# EAGLE design full_Bridge_v2 (EAGLE 9.6.2)

## Sheet 1 of 2
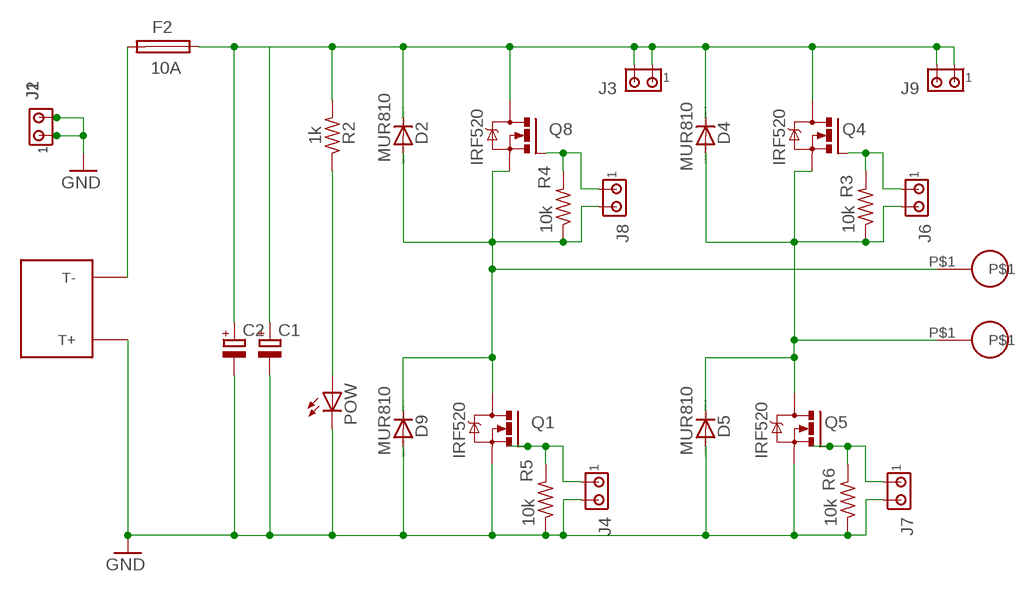
[diagram p0: schematic, sheet 1]

### Parts
AC1  TERMINAL  [TERMINAL]
AC2  TERMINAL  [TERMINAL]
C1  CPOL-EUTT5D10  [TT5D10]
C2  CPOL-EUTT5D10  [TT5D10]
D2  MUR810  [TO220ACS]
D4  MUR810  [TO220ACS]
D5  MUR810  [TO220ACS]
D9  MUR810  [TO220ACS]
F2  10A  SH22,5A  [SH22,5A]
J1  MTA02-100  [10X02MTA]
J2  MTA02-100  [10X02MTA]
J3  MTA02-100  [10X02MTA]
J4  MTA02-100  [10X02MTA]
J6  MTA02-100  [10X02MTA]
J7  MTA02-100  [10X02MTA]
J8  MTA02-100  [10X02MTA]
J9  MTA02-100  [10X02MTA]
POW  LED3MM  [LED3MM]
Q1  IRF520  [TO220BV]
Q4  IRF520  [TO220BV]
Q5  IRF520  [TO220BV]
Q8  IRF520  [TO220BV]
R2  1k  R-US_0207/12  [0207/12]
R3  10k  R-US_0204/7  [0204/7]
R4  10k  R-US_0204/7  [0204/7]
R5  10k  R-US_0204/7  [0204/7]
R6  10k  R-US_0204/7  [0204/7]
U$5  CONNECTOR_BIG  [CONNECTOR_BIG]

### Nets
A_MID: AC1.P$1 D2.A D9.C J8.2 Q1.D Q8.S R4.1
A_MID1: AC2.P$1 D4.A D5.C J6.2 Q4.S Q5.D R3.1
DC_BUS: C1.+ C2.+ D2.C D4.C F2.1 J3.1 J3.2 J9.1 J9.2 Q4.D Q8.D R2.2
GND: C1.- C2.- D5.A D9.A J1.1 J1.2 J2.1 J2.2 J4.2 J7.2 POW.K(C) Q1.S Q5.S R5.1 R6.1 U$5.P$1(T+)
IN+: F2.2 U$5.P$2(T-)
N$1: POW.A R2.1
N$4: J6.1 Q4.G R3.2
N$5: J7.1 Q5.G R6.2
N$10: J4.1 Q1.G R5.2
N$13: J8.1 Q8.G R4.2

## Sheet 2 of 2

## Library data of the parts
AC1 AC2 = terminal:TERMINAL
C1 C2 = rcl:CPOL-EU: POLARIZED CAPACITOR, European symbol
D2 D4 D5 D9 = diode:MUR810: DIODE
F2 = fuse:SH22,5A: FUSE HOLDER grid 22,5mm, isolated cap OGN0031 8201, Schurter (Buerklin); MPN: 0031.7701.11; OC_FARNELL: unknown; OC_NEWARK: 04F1224
J1-J4 J6-J9 = con-amp:MTA02-100: AMP connector
POW = adafruit:LED: LED OSRAM: - CHIPLED LG R971, LG N971, LY N971, LG Q971, LY Q971, LO R971, LY R971 LH N974, LH R974 LS Q976, LO Q976, LY Q976 LO Q996 - Hyper CHIPLED LW Q18S LB Q993, LB Q99A, LB R99A - SideLED LS A670, LO A670, LY A670, LG A670, LP A670 LB A673, LV A673, LT A673, LW A673 LH A674 LY A675 LS A676, LA A676, LO A676, LY A676, LW A676 LS A679, LY A679, LG A679 - Hyper Micro SIDELED® LS Y876, LA Y876, LO Y876, LY Y876 LT Y87S - SmartLED LW L88C, LW L88S LB L89C, LB L89S, LG L890 LS L89K, LO L89K, LY L89K LS L896, LA L896, LO L896, LY L896 - TOPLED LS T670, LO T670, LY T670, LG T670, LP T670 LSG T670, LSP T670, LSY T670, LOP T670, LYG T670 LG T671, LOG T671, LSG T671 LB T673, LV T673, LT T673, LW T673 LH T674 LS T676, LA T676, LO T676, LY T676, LB T676, LH T676, LSB T676, LW T676 LB T67C, LV T67C, LT T67C, LS T67K, LO T67K, LY T67K, LW E67C LS E67B, LA E67B, LO E67B, LY E67B, LB E67C, LV E67C, LT E67C LW T67C LS T679, LY T679, LG T679 LS T770, LO T770, LY T770, LG T770, LP T770 LB T773, LV T773, LT T773, LW T773 LH T774 LS E675, LA E675, LY E675, LS T675 LS T776, LA T776, LO T776, LY T776, LB T776 LHGB T686 LT T68C, LB T68C - Hyper Mini TOPLED® LB M676 - Mini TOPLED Santana® LG M470 LS M47K, LO M47K, LY M47K Source: http://www.osram.convergy.de/
Q1 Q4 Q5 Q8 = transistor-power:IRF520: HEXFET Power MOSFET
R2-R6 = adafruit:R-US_: RESISTOR, American symbol
U$5 = Connector big:CONNECTOR_BIG

## Board
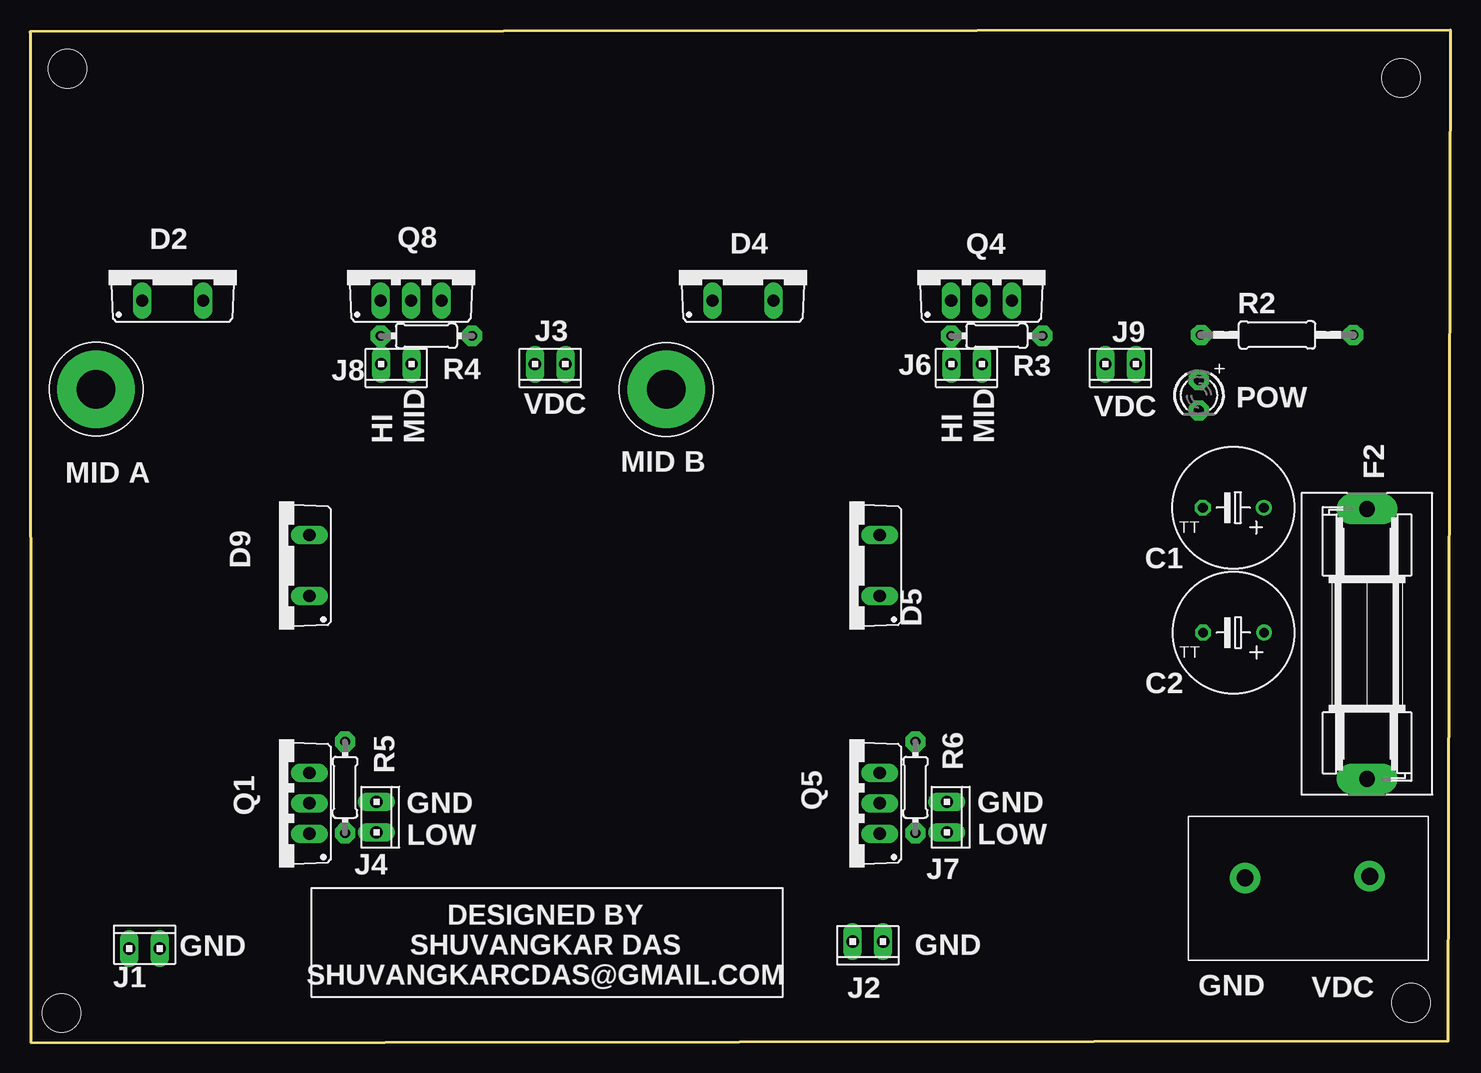
[diagram p1: board, top side]
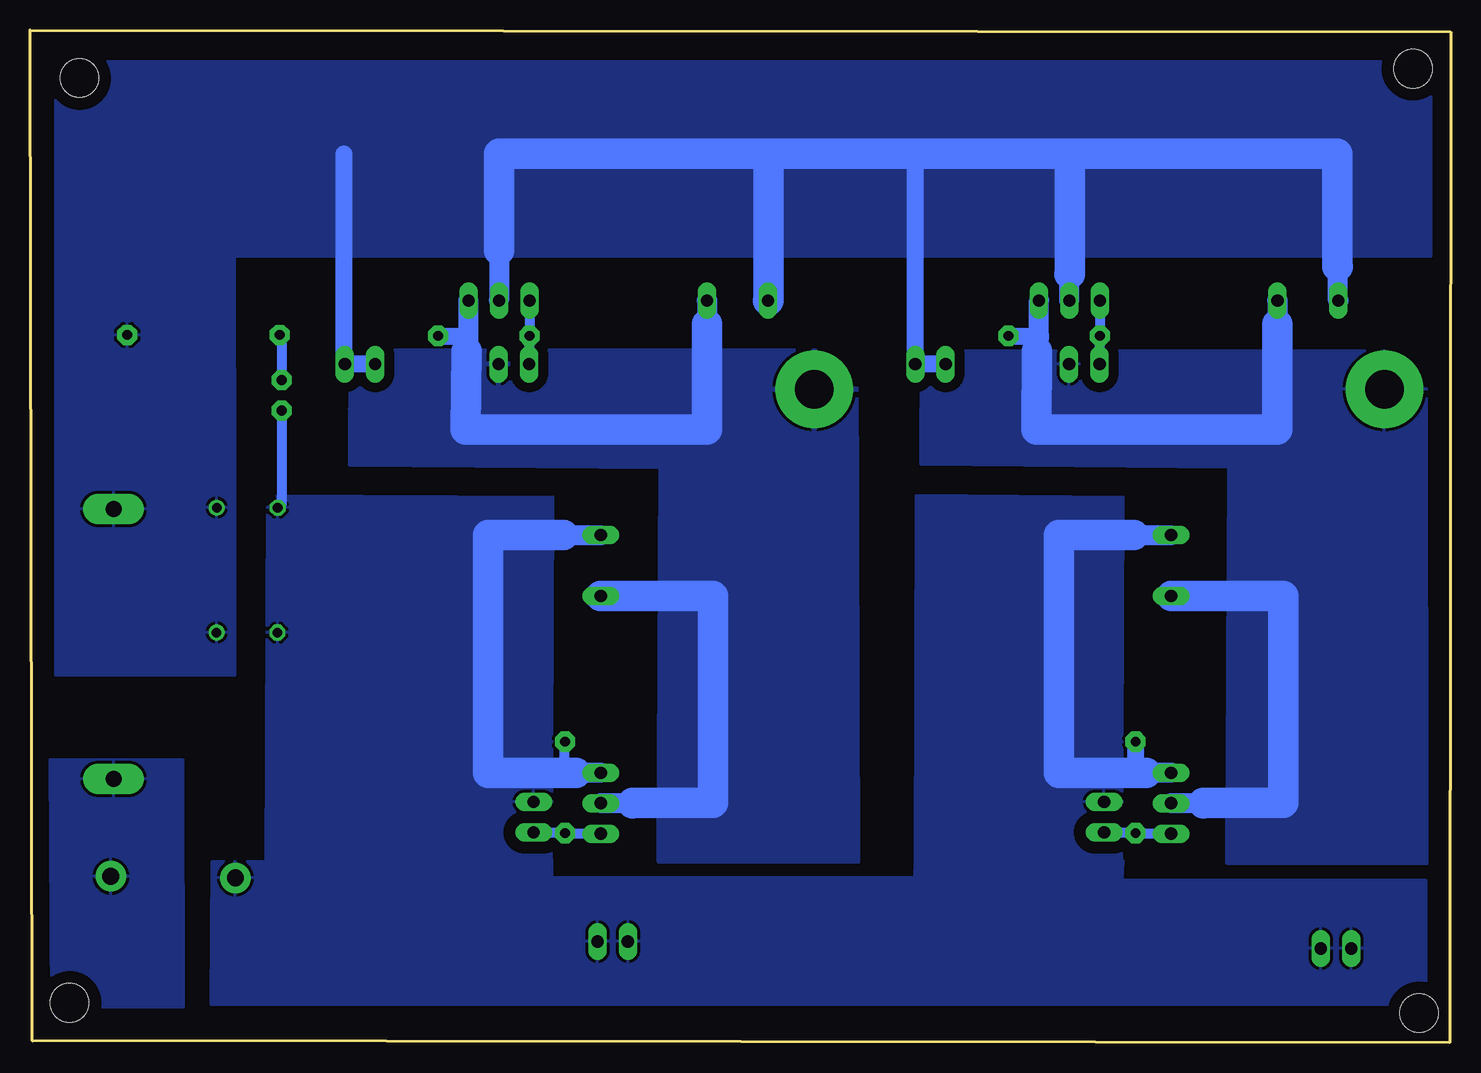
[diagram p2: board, bottom side, seen from below]

Size 118.42 x 84.43 mm. Coordinates in mm from the lower left corner, seen from the top.
Outline: 0.08,0 118.22,0.15 118.42,84.43 0,84.28 0.08,0
Copper layers (1*16): Top 0.035mm / dielectric 1.5mm / Bottom 0.035mm
Design rules "default *": minimum track width 10mil, minimum drill 24mil, track to track 8mil, track to pad 8mil, pad to pad 8mil, via to via 8mil, smd to smd 8mil, copper to edge 40mil, drill to drill 8mil, minimum pad ring 10mil, minimum via ring 8mil, stop-mask expansion 4mil, vias tented up to drill 0mil, thermal gap 10mil
Holes 3.2 mm at 3.12,81.2 114.3,80.42 2.62,2.46 115.11,3.33
vRestrict: area 0.6,4.5 to 20.6,57; area 48.2,5.1 to 68.2,57.7; area 26.3,3.1 to 46.8,57.8; area 73.8,3.4 to 94.3,58.1

### Footprints (pad centres in the part's own frame; a part is rotated, then mirrored left to right if it is on the bottom)
TERMINAL = drill 3.2 pad 6.452: P$1 0,0
TT5D10 = drill 0.813: + -2.54,0 | drill 0.813 octagon: - 2.54,0
TO220ACS = drill 1.016 long: A 2.54,-2.54; C -2.54,-2.54
SH22,5A = drill 1.321 pad 2.54 long: 1 -11.252,0; 2 11.252,0
10X02MTA = drill 1.016 long: 1 1.27,0; 2 -1.27,0
LED3MM = drill 0.813 pad 1.676 octagon: A -1.27,0; K 1.27,0
TO220BV = drill 1.016 long: D 0,-2.54; G -2.54,-2.54; S 2.54,-2.54
0207/12 = drill 0.813 pad 1.676 octagon: 1 -6.35,0; 2 6.35,0
0204/7 = drill 0.813 pad 1.676 octagon: 1 -3.81,0; 2 3.81,0
CONNECTOR_BIG = drill 1.4 pad 2.54: P$1 0.127,-5.254; P$2 0,5.127

### Placement (x,y rotation side)
AC1  5.51,54.48 0 top
AC2  53.04,54.46 0 top
C1  100.3,44.6 180 top
C2  100.33,34.19 180 top
D2  11.89,64.41 0 top
D4  59.44,64.41 0 top
D5  68.3,39.78 90 top
D9  20.75,39.78 90 top
F2  111.46,33.25 270 top
J1  9.55,7.85 0 top
J2  69.85,8.43 180 top
J3  43.36,56.57 180 top
J4  28.88,18.8 270 top
J6  78.08,56.57 180 top
J7  76.43,18.8 270 top
J8  30.53,56.57 180 top
J9  90.91,56.57 180 top
POW  97.43,53.98 270 top
Q1  20.75,19.96 90 top
Q4  79.32,64.41 0 top
Q5  68.3,19.96 90 top
Q8  31.78,64.41 0 top
R2  103.96,59 0 top
R3  80.59,58.93 180 top
R4  33.05,58.93 180 top
R5  26.26,21.29 270 top
R6  73.81,21.29 270 top
U$5  106.55,13.87 270 top

### Tracks (layer width: path | path; a pad name or v marks a point on that pad's centre or on a via)
A_MID
  Bottom 0.813: 34.34,58.93 34.32,58.95
  Bottom 1.422: R4.1 34.49,58.93 34.32,58.75
  Bottom 1.676: 20.63,19.96 Q1.D | D2.A 14.45,61.87 14.45,59.92 | 34.47,57.66 34.32,57.66 34.32,58.75 34.32,58.95 Q8.S
  Bottom 2.54: D9.C 13.94,37.24 13.94,19.99 20.63,19.99 20.63,19.96 | 14.45,59.92 14.45,51.13 34.54,51.13 34.47,57.66
  pour Bottom (isolate 0.813): 44.12,57.73 2.03,57.71 1.98,14.88 18.64,14.91 18.49,47.96 44.15,48.18
A_MID1
  Bottom 1.422: R3.1 81.94,58.93 81.86,59
  Bottom 1.676: 68.17,19.96 Q5.D | D4.A 62,61.87 62,59.92 | 82.02,57.66 81.86,57.66 81.86,59 Q4.S
  Bottom 2.54: D5.C 61.49,37.24 61.49,19.99 68.17,19.99 68.17,19.96 | 62,59.92 62,51.13 82.09,51.13 82.02,57.66
  pour Bottom (isolate 0.813): 91.67,57.73 49.58,57.71 49.43,15.09 65.96,15.11 65.81,48.01 91.69,48.18
DC_BUS
  Bottom 1.422: 44.6,73.51 44.6,56.72 J3.2 J3.1 | 92.25,74.12 92.25,56.57 J9.2 J9.1
  Bottom 1.676: D2.C 9.4,61.87 9.4,64.69 | 79.32,66.04 Q4.D | Q8.D 31.78,64.08
  Bottom 2.54: 9.4,64.69 9.42,64.69 9.42,74.12 31.75,74.12 | 31.75,74.12 56.85,74.12 | 56.85,74.12 79.32,74.12 79.32,66.04 | 31.78,64.08 31.75,64.08 31.75,74.12 | D4.C 56.87,61.87 56.87,64.21 56.85,64.21 56.85,74.12
  pour Bottom: 1.65,65.53 107.42,65.53 107.42,81.81 1.65,81.81
  pour Bottom: 101.37,30.61 116.26,30.61 116.28,81.81 101.4,81.81
GND
  Bottom 0.813: R5.1 26.37,25.09 | R6.1 73.91,25.09 73.91,22.48 | POW.K 97.43,44.93 C1.-
  Bottom 1.422: R5.1 26.26,22.58 26.37,22.48
  Bottom 1.676: Q1.S 25.35,22.5 25.35,22.48 | 26.39,42.32 D9.A | Q5.S 72.9,22.5 72.9,22.48 | 73.94,42.32 D5.A
  Bottom 2.54: 25.35,22.48 26.37,22.48 32.66,22.48 32.66,42.32 26.39,42.32 | 72.9,22.48 73.91,22.48 80.21,22.48 80.21,42.32 73.94,42.32
  pour Bottom (isolate 1.016): 27.25,45.47 44.55,45.62 44.65,14.45 27.41,14.38
  pour Bottom (isolate 1.016): 74.8,45.47 98.65,45.57 98.76,14.4 74.96,14.38
  pour Bottom: 2.87,3.12 103.33,3.17 103.25,15.11 74.96,15.27 74.96,13.77 44.65,13.77 44.6,15.21 27.33,15.21 27.38,13.56 2.08,13.56 2.08,3.12
IN+
  pour Bottom: 105.66,23.57 116.79,23.57 116.64,2.97 105.61,2.97
N$1
  Bottom 0.813: R2.1 97.43,58.14 POW.A
N$4
  Bottom 0.813: Q4.G R3.2 76.81,58.93 J6.1
N$5
  Bottom 0.813: Q5.G 73.81,17.42 R6.2 76.43,17.47 J7.1
N$10
  Bottom 0.813: Q1.G 26.26,17.42 R5.2 28.88,17.47 J4.1
N$13
  Bottom 0.813: Q8.G R4.2 29.26,58.93 J8.1

### Text on the board
tNames: VDC | VDC | HI / MID | HI / MID | MID B | MID A | GND / LOW | GND / LOW | GND | GND | DESIGNED BY / SHUVANGKAR DAS / SHUVANGKARCDAS@GMAIL.COM | GND | VDC